# EAGLE design coax_mixer (EAGLE 5.11)
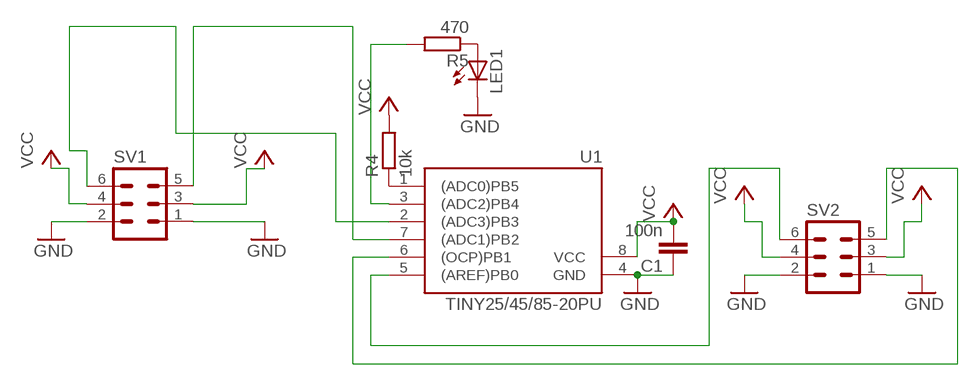
[diagram p0: schematic, sheet 1]

## Parts
C1  100n  C-EUC0805K  [C0805K]
LED1  LEDCHIPLED_0805  [CHIPLED_0805]
R4  10k  R-EU_R0805  [R0805]
R5  470  R-EU_R0805  [R0805]
SV1  MA03-2  [MA03-2]
SV2  MA03-2  [MA03-2]
U1  TINY25/45/85-20PU  [DIL08]

## Nets
GND [power]: C1.1 LED1.C SV1.1 SV1.2 SV2.1 SV2.2 U1.4(GND)
N$1: LED1.A R5.1
N$2: SV2.5 U1.6((OCP)PB1)
N$3: SV1.6 U1.2((ADC3)PB3)
N$4: SV2.6 U1.5((AREF)PB0)
N$5: R4.1 U1.1((ADC0)PB5)
N$6: SV1.5 U1.7((ADC1)PB2)
N$11: R5.2 U1.3((ADC2)PB4)
VCC [power]: C1.2 R4.2 SV1.3 SV1.4 SV2.3 SV2.4 U1.8(VCC)

## Library data of the parts
C1 = resistor:C-EU: CAPACITOR, European symbol
LED1 = led:LED: LED OSRAM: - CHIPLED LG R971, LG N971, LY N971, LG Q971, LY Q971, LO R971, LY R971 LH N974, LH R974 LS Q976, LO Q976, LY Q976 LO Q996 - Hyper CHIPLED LW Q18S LB Q993, LB Q99A, LB R99A - SideLED LS A670, LO A670, LY A670, LG A670, LP A670 LB A673, LV A673, LT A673, LW A673 LH A674 LY A675 LS A676, LA A676, LO A676, LY A676, LW A676 LS A679, LY A679, LG A679 - Hyper Micro SIDELED® LS Y876, LA Y876, LO Y876, LY Y876 LT Y87S - SmartLED LW L88C, LW L88S LB L89C, LB L89S, LG L890 LS L89K, LO L89K, LY L89K LS L896, LA L896, LO L896, LY L896 - TOPLED LS T670, LO T670, LY T670, LG T670, LP T670 LSG T670, LSP T670, LSY T670, LOP T670, LYG T670 LG T671, LOG T671, LSG T671 LB T673, LV T673, LT T673, LW T673 LH T674 LS T676, LA T676, LO T676, LY T676, LB T676, LH T676, LSB T676, LW T676 LB T67C, LV T67C, LT T67C, LS T67K, LO T67K, LY T67K, LW E67C LS E67B, LA E67B, LO E67B, LY E67B, LB E67C, LV E67C, LT E67C LW T67C LS T679, LY T679, LG T679 LS T770, LO T770, LY T770, LG T770, LP T770 LB T773, LV T773, LT T773, LW T773 LH T774 LS E675, LA E675, LY E675, LS T675 LS T776, LA T776, LO T776, LY T776, LB T776 LHGB T686 LT T68C, LB T68C - Hyper Mini TOPLED® LB M676 - Mini TOPLED Santana® LG M470 LS M47K, LO M47K, LY M47K Source: http://www.osram.convergy.de LUXEON: - LUMILED® LXK2-PW12-R00, LXK2-PW12-S00, LXK2-PW14-U00, LXK2-PW14-V00 LXK2-PM12-R00, LXK2-PM12-S00, LXK2-PM14-U00 LXK2-PE12-Q00, LXK2-PE12-R00, LXK2-PE12-S00, LXK2-PE14-T00, LXK2-PE14-U00 LXK2-PB12-K00, LXK2-PB12-L00, LXK2-PB12-M00, LXK2-PB14-N00, LXK2-PB14-P00, LXK2-PB14-Q00 LXK2-PR12-L00, LXK2-PR12-M00, LXK2-PR14-Q00, LXK2-PR14-R00 LXK2-PD12-Q00, LXK2-PD12-R00, LXK2-PD12-S00 LXK2-PH12-R00, LXK2-PH12-S00 LXK2-PL12-P00, LXK2-PL12-Q00, LXK2-PL12-R00 Source: www.luxeon.com KINGBRIGHT: KA-3528ASYC Source: www.kingbright.com
R4 R5 = resistor:R-EU_: RESISTOR, European symbol
SV1 SV2 = con-lstb:MA03-2: PIN HEADER; OC_FARNELL: unknown; OC_NEWARK: unknown
U1 = avr-6:TINY25/45/85

## Net classes
0 default: width 0.406 mm, drill 0.5 mm
1 power: width 0.61 mm, drill 0.5 mm

## Board
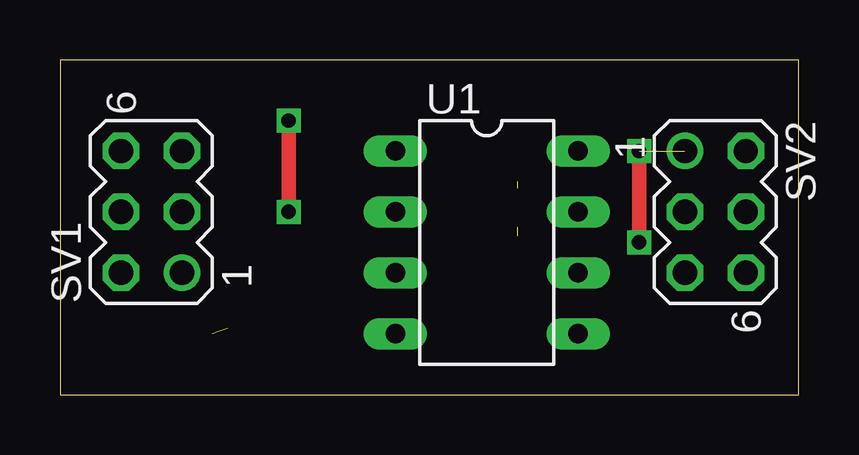
[diagram p1: board, top side]
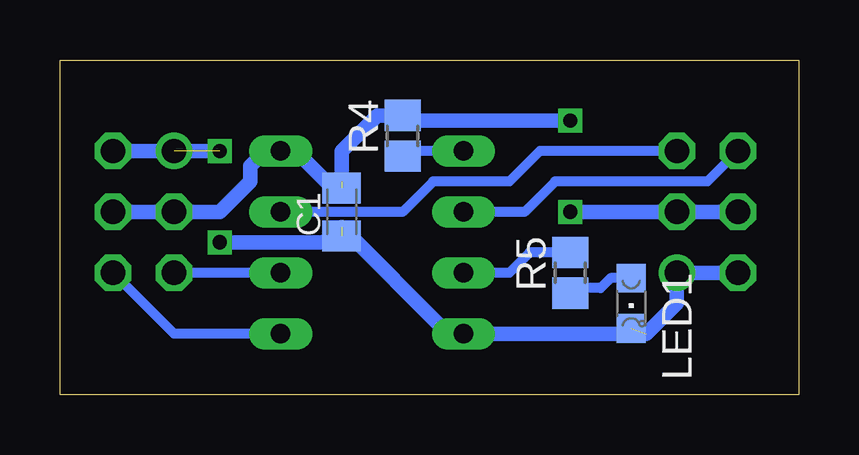
[diagram p2: board, bottom side, seen from below]

Size 30.79 x 13.96 mm. Coordinates in mm from the lower left corner, seen from the top.
Outline: 0,0 30.79,0 30.79,13.96 0,13.96 0,0
Copper layers (1*16): Top 0.035mm / dielectric 1.5mm / Bottom 0.035mm
Design rules "default": minimum track width 10mil, minimum drill 24mil, track to track 8mil, track to pad 8mil, pad to pad 8mil, via to via 8mil, smd to smd 8mil, copper to edge 40mil, drill to drill 8mil, minimum pad ring 10mil, minimum via ring 8mil, stop-mask expansion 4mil, vias tented up to drill 0mil, thermal gap 10mil

### Footprints (pad centres in the part's own frame; a part is rotated, then mirrored left to right if it is on the bottom)
C0805K = smd 1.3 x 1.6: 1 -1,0; 2 1,0
CHIPLED_0805 = smd 1.2 x 1.2: A 0,-1.05; C 0,1.05
R0805 = smd 1.3 x 1.5: 1 -0.85,0; 2 0.85,0
MA03-2 = drill 1.016 round: 1 -2.54,-1.27 | drill 1.016 octagon: 2 -2.54,1.27; 3 0,-1.27; 4 0,1.27; 5 2.54,-1.27; 6 2.54,1.27
DIL08 = drill 0.813 long: 1 -3.81,-3.81; 2 -1.27,-3.81; 3 1.27,-3.81; 4 3.81,-3.81; 5 3.81,3.81; 6 1.27,3.81; 7 -1.27,3.81; 8 -3.81,3.81

### Placement (x,y rotation side)
C1  19.05,7.62 90 bottom
LED1  6.98,3.81 180 bottom
R4  16.51,10.79 90 bottom
R5  9.53,5.08 90 bottom
SV1  3.81,7.62 90 top
SV2  27.3,7.62 270 top
U1  17.78,6.35 270 top

### Tracks (layer width: path | path; a pad name or v marks a point on that pad's centre or on a via)
GND  (via drill 0.6)  (3 unrouted)
  Top 0.61: v24.13,6.35 v24.13,10.16
  Bottom 0.61: SV1.2 SV1.1 5.08,3.81 6.35,2.54 U1.4 14.61,2.54 19.05,6.98 | v24.13,10.16 SV2.2 | v24.13,6.35 19.95,6.35 C1.1
N$1
  Bottom 0.406: LED1.A 7.84,4.86 8.26,4.45 9.31,4.45 R5.1
N$2
  Bottom 0.406: U1.6 SV2.5
N$3
  Bottom 0.406: SV1.6 3.81,8.89 10.16,8.89 11.43,7.62 U1.2
N$4
  Bottom 0.406: U1.5 26.04,2.54 SV2.6
N$5
  Bottom 0.406: U1.1 16.3,10.16 R4.1
N$6
  Bottom 0.406: SV1.5 10.79,10.16 12.06,8.89 15.24,8.89 16.51,7.62 U1.7
N$11
  Bottom 0.406: R5.2 11.21,5.93 12.06,5.08 U1.3
VCC  (via drill 0.6)  (1 unrouted)
  Top 0.61: v9.53,7.62 v9.53,11.43
  Bottom 0.61: SV1.4 SV1.3 v9.53,7.62 | v9.53,11.43 16.09,11.43 R4.2 17.57,11.64 19.05,10.16 19.05,8.89 19.68,8.89 20.95,10.16 U1.8 22.22,10.16 22.86,9.53 22.86,8.89 24.13,7.62 SV2.3 SV2.4